# EAGLE schematic video_board (EAGLE 7.5.0)
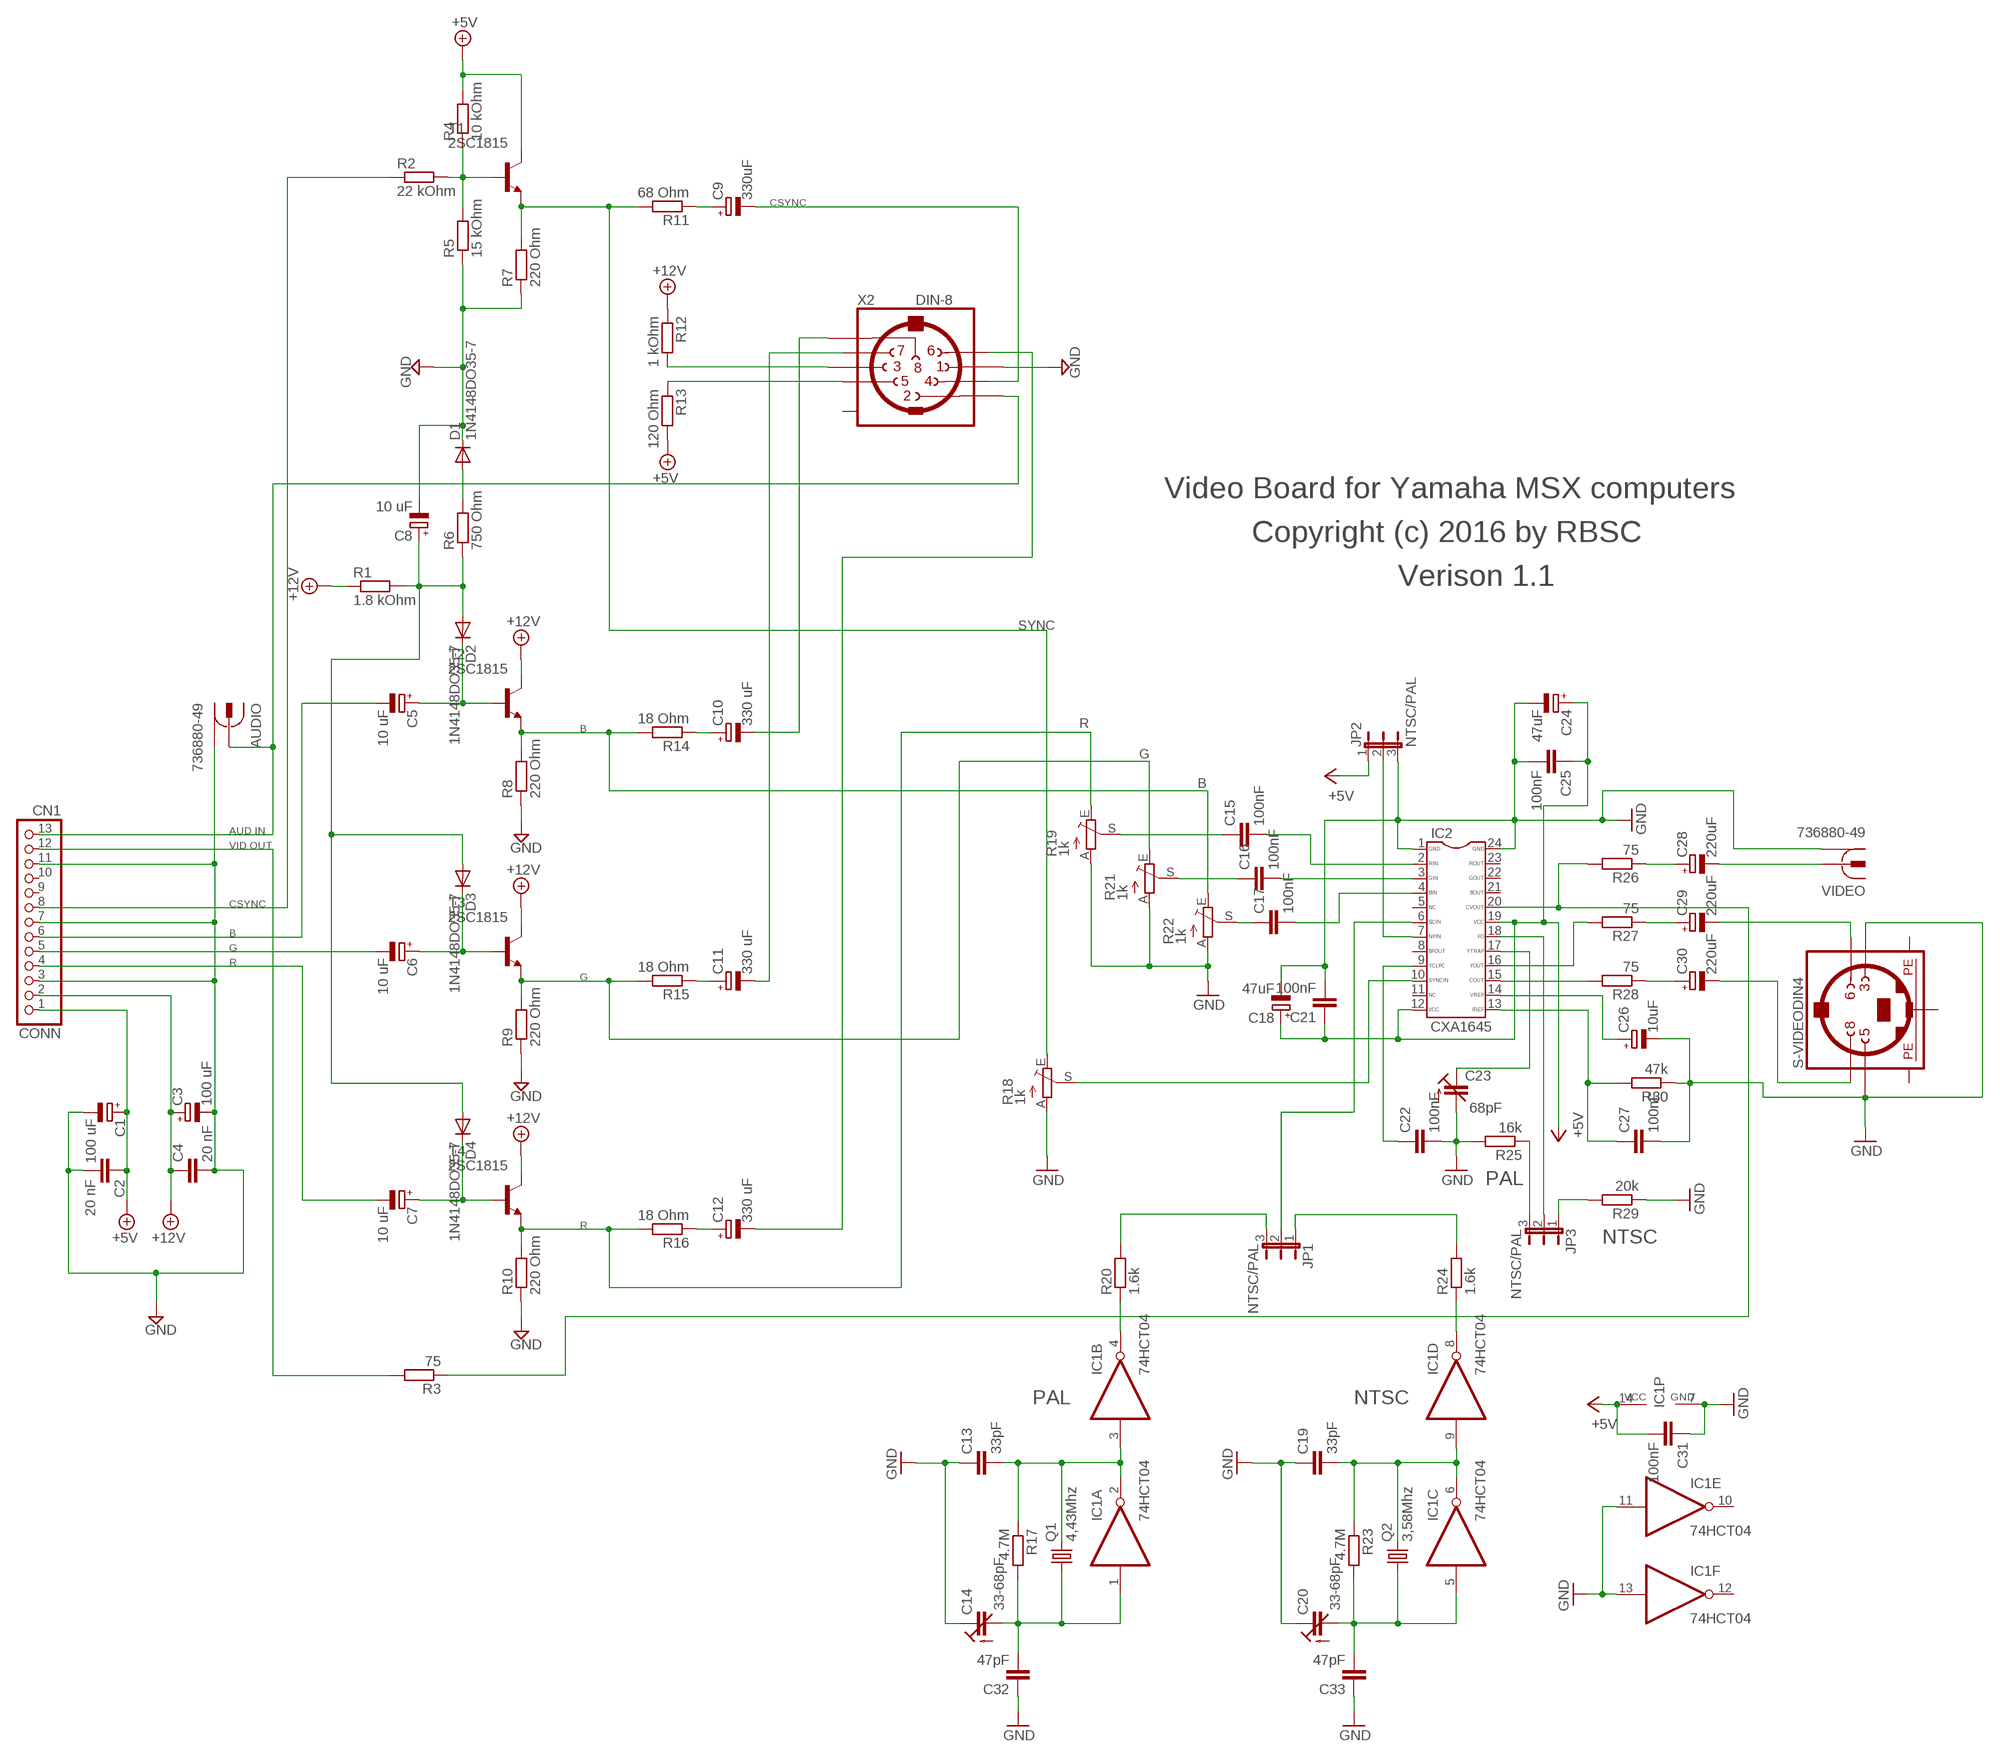
[diagram p0: schematic, sheet 1]

## Parts
AUDIO  736880-49  [736880-49]
C1  100 uF  CPOL-EUSMCD  [SMC_D]
C2  20 nF  C-EUC0805  [C0805]
C3  100 uF  CPOL-EUSMCD  [SMC_D]
C4  20 nF  C-EUC0805  [C0805]
C5  10 uF  CPOL-EUSMCB  [SMC_B]
C6  10 uF  CPOL-EUSMCB  [SMC_B]
C7  10 uF  CPOL-EUSMCB  [SMC_B]
C8  10 uF  CPOL-EUSMCB  [SMC_B]
C9  330uF  CPOL-EUSMCD  [SMC_D]
C10  330 uF  CPOL-EUSMCD  [SMC_D]
C11  330 uF  CPOL-EUSMCD  [SMC_D]
C12  330 uF  CPOL-EUSMCD  [SMC_D]
C13  33pF  C-EUC0805  [C0805]
C14  33-68pF  C-TRIMMTZ03  [CTRIMTZ03]
C15  100nF  C-EUC0805  [C0805]
C16  100nF  C-EUC0805  [C0805]
C17  100nF  C-EUC0805  [C0805]
C18  47uF  CPOL-EUSMCB  [SMC_B]
C19  33pF  C-EUC0805  [C0805]
C20  33-68pF  C-TRIMMTZ03  [CTRIMTZ03]
C21  100nF  C-EUC0805  [C0805]
C22  100nF  C-EUC0805  [C0805]
C23  68pF  C-TRIMMTZ03  [CTRIMTZ03]
C24  47uF  CPOL-EUSMCB  [SMC_B]
C25  100nF  C-EUC0805  [C0805]
C26  10uF  CPOL-EUSMCB  [SMC_B]
C27  100nF  C-EUC0805  [C0805]
C28  220uF  CPOL-EUSMCD  [SMC_D]
C29  220uF  CPOL-EUSMCD  [SMC_D]
C30  220uF  CPOL-EUSMCD  [SMC_D]
C31  100nF  C-EUC0805  [C0805]
C32  47pF  C-EUC0805  [C0805]
C33  47pF  C-EUC0805  [C0805]
CONN  CN1  PINHD-1X13  [1X13]
D1  1N4148DO35-7  DIODE-MINIMELF  [MINIMELF]
D2  1N4148DO35-7  DIODE-MINIMELF  [MINIMELF]
D3  1N4148DO35-7  DIODE-MINIMELF  [MINIMELF]
D4  1N4148DO35-7  DIODE-MINIMELF  [MINIMELF]
IC1  74HCT04  74HCT04D  [SO14]
IC2  CXA1645  [SOP24]
JP1  NTSC/PAL  JP2E  [JP2]
JP2  NTSC/PAL  JP2E  [JP2]
JP3  NTSC/PAL  JP2E  [JP2]
Q1  4,43Mhz  CRYSTALHC49S  [HC49/S]
Q2  3,58Mhz  CRYSTALHC49S  [HC49/S]
R1  1.8 kOhm  R-EU_R0805  [R0805]
R2  22 kOhm  R-EU_R0805  [R0805]
R3  75  R-EU_R0805  [R0805]
R4  10 kOhm  R-EU_R0805  [R0805]
R5  15 kOhm  R-EU_R0805  [R0805]
R6  750 Ohm  R-EU_R0805  [R0805]
R7  220 Ohm  R-EU_R0805  [R0805]
R8  220 Ohm  R-EU_R0805  [R0805]
R9  220 Ohm  R-EU_R0805  [R0805]
R10  220 Ohm  R-EU_R0805  [R0805]
R11  68 Ohm  R-EU_R0805  [R0805]
R12  1 kOhm  R-EU_R0805  [R0805]
R13  120 Ohm  R-EU_R0805  [R0805]
R14  18 Ohm  R-EU_R0805  [R0805]
R15  18 Ohm  R-EU_R0805  [R0805]
R16  18 Ohm  R-EU_R0805  [R0805]
R17  4.7M  R-EU_R0805  [R0805]
R18  1k  TRIM_EU-CA6V  [CA6V]
R19  1k  TRIM_EU-CA6V  [CA6V]
R20  1.6k  R-EU_R0805  [R0805]
R21  1k  TRIM_EU-CA6V  [CA6V]
R22  1k  TRIM_EU-CA6V  [CA6V]
R23  4.7M  R-EU_R0805  [R0805]
R24  1.6k  R-EU_R0805  [R0805]
R25  16k  R-EU_R0805  [R0805]
R26  75  R-EU_R0805  [R0805]
R27  75  R-EU_R0805  [R0805]
R28  75  R-EU_R0805  [R0805]
R29  20k  R-EU_R0805  [R0805]
R30  47k  R-EU_R0805  [R0805]
S-VIDEO  DIN4  MINI_DIN_4  [M_DIN4]
T1  2SC1815  [TO92-ECB]
T2  2SC1815  [TO92-ECB]
T3  2SC1815  [TO92-ECB]
T4  2SC1815  [TO92-ECB]
VIDEO  736880-49  [736880-49]
X2  DIN-8  [DIN8]

## Nets
+5V: C1.+ C2.1 C18.+ C21.1 C24.+ C25.1 C31.2 CONN.1 IC1.14(P:VCC) IC2.12 IC2.19 JP2.1 R4.2 R13.2 T1.C
+12V: C3.+ C4.1 CONN.2 R1.1 R12.1 T2.C T3.C T4.C
GND: AUDIO.1 AUDIO.1@1 AUDIO.1@2 C1.- C2.2 C3.- C4.2 C8.- C13.1 C14.1(E) C18.- C19.1 C20.1(E) C21.2 C22.2 C23.2(A) C24.- C25.2 C26.- C27.2 C31.1 C32.1 C33.1 CONN.3 CONN.7 CONN.11 D1.C IC1.7(P:GND) IC1.11(E:I) IC1.13(F:I) IC2.1 IC2.24 JP2.3 R5.1 R7.1 R8.1 R9.1 R10.1 R18.A R19.A R21.A R22.A R25.2 R29.1 R30.1 S-VIDEO.3 S-VIDEO.5 VIDEO.1 VIDEO.1@1 VIDEO.1@2 X2.1
N$1: R10.2 R16.2 R19.E T4.E
N$2: C20.2(A) C33.2 IC1.5(C:I) Q2.1 R23.2
N$3: JP1.1 R24.2
N$4: CONN.8 R2.1
N$5: R8.2 R14.2 R22.E T2.E
N$6: C15.1 R19.S
N$7: C16.1 R21.S
N$8: IC1.4(B:O) R20.1
N$9: IC1.8(D:O) R24.1
N$10: C19.2 IC1.6(C:O) IC1.9(D:I) Q2.2 R23.1
N$11: JP1.3 R20.2
N$12: C8.+ D2.A D3.A D4.A R1.2 R6.1
N$13: JP3.3 R25.1
N$14: IC2.7 JP2.2
N$15: JP3.1 R29.2
N$16: IC2.16 R27.2
N$19: CONN.12 R3.2
N$24: C23.1(E) IC2.17
N$26: C12.- X2.6
N$27: C11.- X2.7
N$29: C6.+ D3.C T3.B
N$30: C10.- X2.8
N$31: D1.A R6.2
N$32: C6.- CONN.5
N$33: C5.- CONN.6
N$34: AUDIO.2 CONN.13 X2.2
N$35: C12.+ R16.1
N$36: R12.2 X2.3
N$37: R9.2 R15.2 R21.E T3.E
N$38: R13.1 X2.5
N$39: C7.+ D4.C T4.B
N$42: C7.- CONN.4
N$43: C5.+ D2.C T2.B
N$47: R2.2 R4.1 R5.2 T1.B
N$50: R7.2 R11.2 R18.E T1.E
N$51: C11.+ R15.1
N$52: C10.+ R14.1
N$53: C9.+ R11.1
N$54: C9.- X2.4
N$55: C17.1 R22.S
N$56: C16.2 IC2.3
N$57: C15.2 IC2.2
N$58: C17.2 IC2.4
N$59: C14.2(A) C32.2 IC1.1(A:I) Q1.1 R17.2
N$60: C13.2 IC1.2(A:O) IC1.3(B:I) Q1.2 R17.1
N$61: IC2.10 R18.S
N$63: IC2.6 JP1.2
N$64: IC2.20 R3.1 R26.2
N$65: C22.1 IC2.9
N$66: IC2.18 JP3.2
N$68: IC2.15 R28.2
N$69: C28.+ R26.1
N$70: C29.+ R27.1
N$71: C30.+ R28.1
N$72: C26.+ IC2.14
N$73: C27.1 IC2.13 R30.2
N$75: C28.- VIDEO.2
N$78: C29.- S-VIDEO.6
N$79: C30.- S-VIDEO.8
Unconnected: CONN.9 CONN.10 IC1.10(E:O) IC1.12(F:O) IC2.5 IC2.8 IC2.11 IC2.21 IC2.22 IC2.23 X2.GND

## Notes on the sheet
- CSYNC
- Video Board for Yamaha MSX computers
- Copyright (c) 2016 by RBSC
- Verison 1.1
- SYNC
- R
- B
- G
- B
- AUD IN
- VID OUT
- CSYNC
- B
- G
- R
- G
- PAL
- R
- NTSC
- PAL | NTSC

## Power pins joined to a net without a drawn wire
PE1: S-VIDEO.SH1(PE1)
PE2: S-VIDEO.SH2(PE2)
PE3: S-VIDEO.SH3(PE3)

## Library data of the parts
AUDIO VIDEO = con-conrad:736880-49: Cinch Connector ( RCA Jack ) Cinch-Einbaukupplung 90º 72345 Vernickelt BKL Electronic Source: Conrad <http://www.conrad.de/ce/de/product/736880>
C1 C3 C5-C12 = rcl:CPOL-EU: POLARIZED CAPACITOR, European symbol
C2 C4 = rcl:C-EU: CAPACITOR, European symbol
C13 C15-C17 C19 C21 C22 C25 C27 C31-C33 = rcl:C-EU: CAPACITOR, European symbol; OC_FARNELL: unknown
C14 C20 = rcl:C-TRIMM: Trimm capacitor; OC_FARNELL: unknown
C18 C24 C26 C28-C30 = rcl:CPOL-EU: POLARIZED CAPACITOR, European symbol; OC_FARNELL: unknown
C23 = rcl:C-TRIMM: Trimm capacitor
CONN = pinhead:PINHD-1X13: PIN HEADER
D1-D4 = diode:DIODE-: DIODE
IC1 = 74xx-eu:74*04: Hex INVERTER
IC2 = CXA1645M:CXA1645; OC_FARNELL: unknown
JP1-JP3 = jumper:JP2E: JUMPER
Q1 Q2 = crystal:CRYSTAL: CRYSTAL; MF: MULTICOMP; MPN: HC49SM-3.6864-30-50-60-16-ATF; OC_FARNELL: 1667008; OC_NEWARK: unknown
R1 R2 R4-R16 = resistor:R-EU_: RESISTOR, European symbol
R3 R17 R20 R23-R30 = rcl:R-EU_: RESISTOR, European symbol; OC_FARNELL: unknown
R18 R19 R21 R22 = pot:TRIM_EU-: POTENTIOMETER; OC_FARNELL: unknown
S-VIDEO = mini_din:MINI_DIN_4
T1-T4 = transistor:2SC1815: NPN EPITAXIAL TRANSISTOR Source: TOSHIBA .. 2SC1815 1.pdf
X2 = din8:DIN-8: Female CONNECTOR 8 pins with shield, horizontal (DIN 41524)